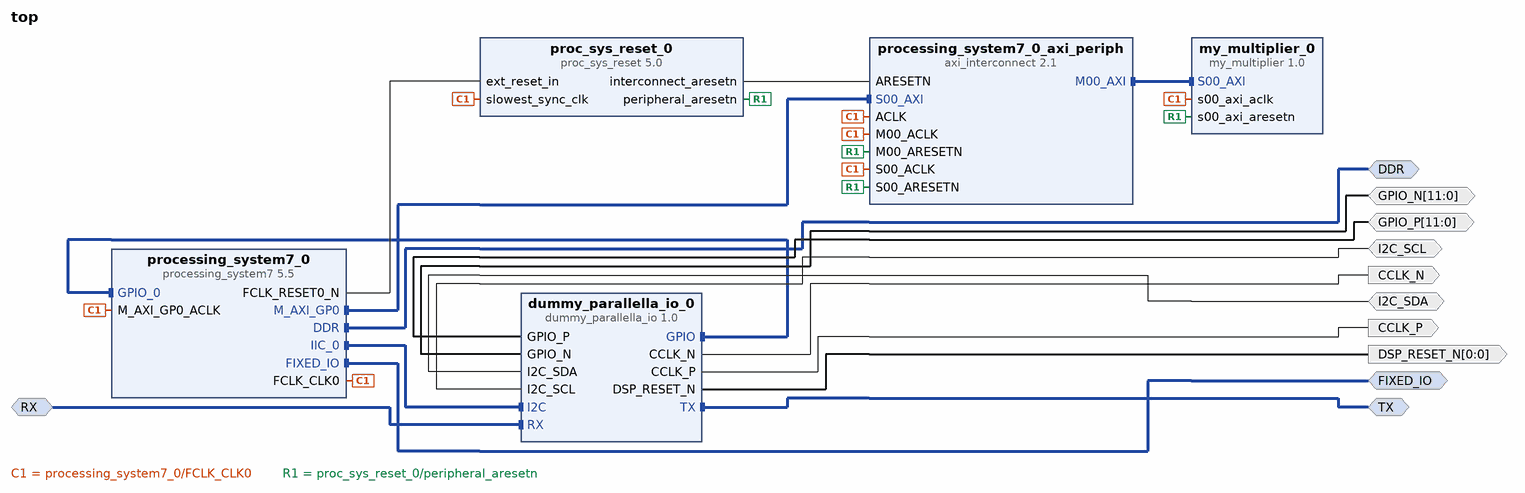
[diagram p0: block diagram of the top level]
# Vivado block design top, Vivado 2015.4
create_bd_design top

create_bd_intf_port -mode Master -vlnv xilinx.com:interface:ddrx_rtl:1.0 DDR
create_bd_intf_port -mode Master -vlnv xilinx.com:display_processing_system7:fixedio_rtl:1.0 FIXED_IO
create_bd_intf_port -mode Slave -vlnv adapteva.com:interface:eLink_rtl:1.0 RX
create_bd_intf_port -mode Master -vlnv adapteva.com:interface:eLink_rtl:1.0 TX
create_bd_port -dir O CCLK_N
create_bd_port -dir O CCLK_P
create_bd_port -dir O -from 0 -to 0 DSP_RESET_N
create_bd_port -dir IO -from 11 -to 0 GPIO_N
create_bd_port -dir IO -from 11 -to 0 GPIO_P
create_bd_port -dir IO I2C_SCL
create_bd_port -dir IO I2C_SDA

create_bd_cell -type ip -vlnv k88k:user:dummy_parallella_io:1.0 dummy_parallella_io_0
set_property -dict {CONFIG.NUM_GPIO_PAIRS 12} [get_bd_cells dummy_parallella_io_0]
create_bd_cell -type ip -vlnv xilinx.com:ip:proc_sys_reset:5.0 proc_sys_reset_0
create_bd_cell -type ip -vlnv xilinx.com:ip:processing_system7:5.5 processing_system7_0
set_property -dict [list \
  CONFIG.PCW_UIPARAM_DDR_FREQ_MHZ 400 \
  CONFIG.PCW_SDIO_PERIPHERAL_FREQMHZ 50 \
  CONFIG.PCW_FPGA0_PERIPHERAL_FREQMHZ 100 \
  CONFIG.PCW_FPGA3_PERIPHERAL_FREQMHZ 100 \
  CONFIG.PCW_EN_CLK3_PORT 1 \
  CONFIG.PCW_PRESET_BANK1_VOLTAGE {LVCMOS 1.8V} \
  CONFIG.PCW_UIPARAM_DDR_PARTNO Custom \
  CONFIG.PCW_QSPI_PERIPHERAL_ENABLE 1 \
  CONFIG.PCW_ENET0_PERIPHERAL_ENABLE 1 \
  CONFIG.PCW_ENET0_ENET0_IO {MIO 16 .. 27} \
  CONFIG.PCW_ENET0_GRP_MDIO_ENABLE 1 \
  CONFIG.PCW_SD1_PERIPHERAL_ENABLE 1 \
  CONFIG.PCW_SD1_SD1_IO {MIO 10 .. 15} \
  CONFIG.PCW_UART1_PERIPHERAL_ENABLE 1 \
  CONFIG.PCW_UART1_UART1_IO {MIO 8 .. 9} \
  CONFIG.PCW_USB0_PERIPHERAL_ENABLE 1 \
  CONFIG.PCW_USB1_PERIPHERAL_ENABLE 1 \
  CONFIG.PCW_I2C0_PERIPHERAL_ENABLE 1 \
  CONFIG.PCW_GPIO_MIO_GPIO_ENABLE 1 \
  CONFIG.PCW_GPIO_EMIO_GPIO_ENABLE 1 \
] [get_bd_cells processing_system7_0]
# 24 more settings of processing_system7_0 are not shown: defaults, MIO pin electricals, DDR timing, and values the tool derives
create_bd_cell -type ip -vlnv k88k:user:my_multiplier:1.0 my_multiplier_0
create_bd_cell -type ip -vlnv xilinx.com:ip:axi_interconnect:2.1 processing_system7_0_axi_periph
set_property -dict {CONFIG.NUM_MI 1} [get_bd_cells processing_system7_0_axi_periph]

# ---- connections ----

connect_bd_intf_net [get_bd_intf_pins dummy_parallella_io_0/GPIO] [get_bd_intf_pins processing_system7_0/GPIO_0]
connect_bd_intf_net [get_bd_intf_pins dummy_parallella_io_0/I2C] [get_bd_intf_pins processing_system7_0/IIC_0]
connect_bd_intf_net [get_bd_intf_pins processing_system7_0/M_AXI_GP0] [get_bd_intf_pins processing_system7_0_axi_periph/S00_AXI]
connect_bd_intf_net [get_bd_intf_pins my_multiplier_0/S00_AXI] [get_bd_intf_pins processing_system7_0_axi_periph/M00_AXI]
connect_bd_intf_net [get_bd_intf_ports DDR] [get_bd_intf_pins processing_system7_0/DDR]
connect_bd_intf_net [get_bd_intf_ports FIXED_IO] [get_bd_intf_pins processing_system7_0/FIXED_IO]
connect_bd_intf_net [get_bd_intf_ports RX] [get_bd_intf_pins dummy_parallella_io_0/RX]
connect_bd_intf_net [get_bd_intf_ports TX] [get_bd_intf_pins dummy_parallella_io_0/TX]
connect_bd_net [get_bd_ports GPIO_P] [get_bd_pins dummy_parallella_io_0/GPIO_P]
connect_bd_net [get_bd_ports GPIO_N] [get_bd_pins dummy_parallella_io_0/GPIO_N]
connect_bd_net [get_bd_ports I2C_SDA] [get_bd_pins dummy_parallella_io_0/I2C_SDA]
connect_bd_net [get_bd_ports I2C_SCL] [get_bd_pins dummy_parallella_io_0/I2C_SCL]
connect_bd_net [get_bd_pins dummy_parallella_io_0/CCLK_N] [get_bd_ports CCLK_N]
connect_bd_net [get_bd_pins dummy_parallella_io_0/CCLK_P] [get_bd_ports CCLK_P]
connect_bd_net [get_bd_pins dummy_parallella_io_0/DSP_RESET_N] [get_bd_ports DSP_RESET_N]
connect_bd_net [get_bd_pins processing_system7_0/FCLK_CLK0] \
  [get_bd_pins proc_sys_reset_0/slowest_sync_clk] [get_bd_pins my_multiplier_0/s00_axi_aclk] \
  [get_bd_pins processing_system7_0/M_AXI_GP0_ACLK] [get_bd_pins processing_system7_0_axi_periph/ACLK] \
  [get_bd_pins processing_system7_0_axi_periph/M00_ACLK] [get_bd_pins processing_system7_0_axi_periph/S00_ACLK]
connect_bd_net [get_bd_pins processing_system7_0/FCLK_RESET0_N] [get_bd_pins proc_sys_reset_0/ext_reset_in]
connect_bd_net [get_bd_pins proc_sys_reset_0/interconnect_aresetn] [get_bd_pins processing_system7_0_axi_periph/ARESETN]
connect_bd_net [get_bd_pins proc_sys_reset_0/peripheral_aresetn] \
  [get_bd_pins my_multiplier_0/s00_axi_aresetn] [get_bd_pins processing_system7_0_axi_periph/M00_ARESETN] \
  [get_bd_pins processing_system7_0_axi_periph/S00_ARESETN]

# ---- address map ----
assign_bd_address -offset 0x70020000 -range 4K -target_address_space [get_bd_addr_spaces processing_system7_0/Data] [get_bd_addr_segs my_multiplier_0/S00_AXI/S00_AXI_reg]

validate_bd_design
save_bd_design
